# Altium schematic sheet CABLE MKIV.SchDoc
size A4
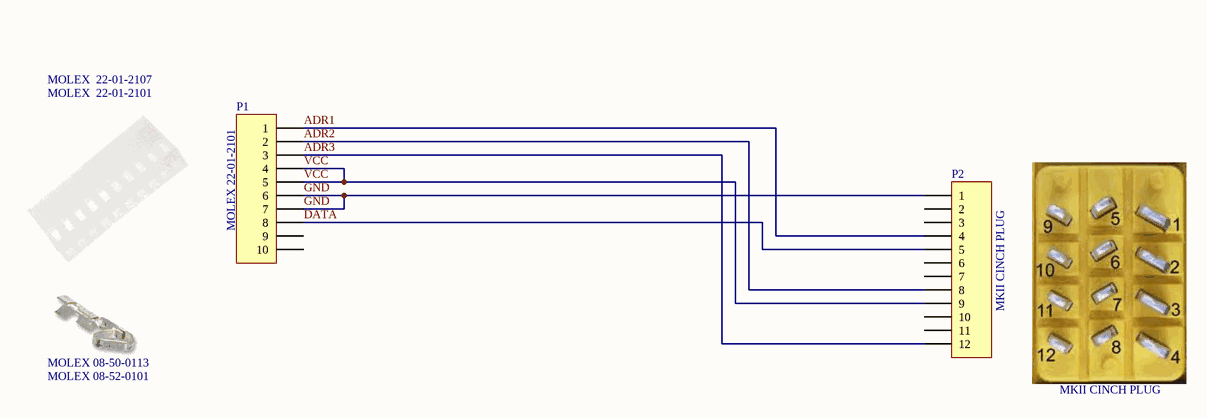
[diagram p0: CABLE MKIV.SchDoc]

## Parts
P1  MOLEX 22-01-2101  [HDR1X10]
P2  MKII CINCH PLUG  [HDR1X12]

## Nets
ADR1: P1.1 P2.4
ADR2: P1.2 P2.8
ADR3: P1.3 P2.12
DATA: P1.8 P2.5
GND: P1.6 P1.7 P2.1
VCC: P1.4 P1.5 P2.9

Not connected (* = marked no-connect by the designer): P1 9 10; P2 2 3 6 7 10 11

## Notes on the sheet
- MOLEX  22-01-2101
- MOLEX  22-01-2107
- MOLEX 08-50-0113
- MOLEX 08-52-0101
- MKII CINCH PLUG

## Library data of the parts
P1 = Header 10: Header, 10-Pin; LatestRevisionDate: 17-Jul-2002; LatestRevisionNote: Re-released for DXP Platform.; Publisher: Altium Limited
P2 = Header 12: Header, 12-Pin; LatestRevisionDate: 17-Jul-2002; LatestRevisionNote: Re-released for DXP Platform.; Publisher: Altium Limited